# Altium project PA_CPLBridge_R01.PrjPcb
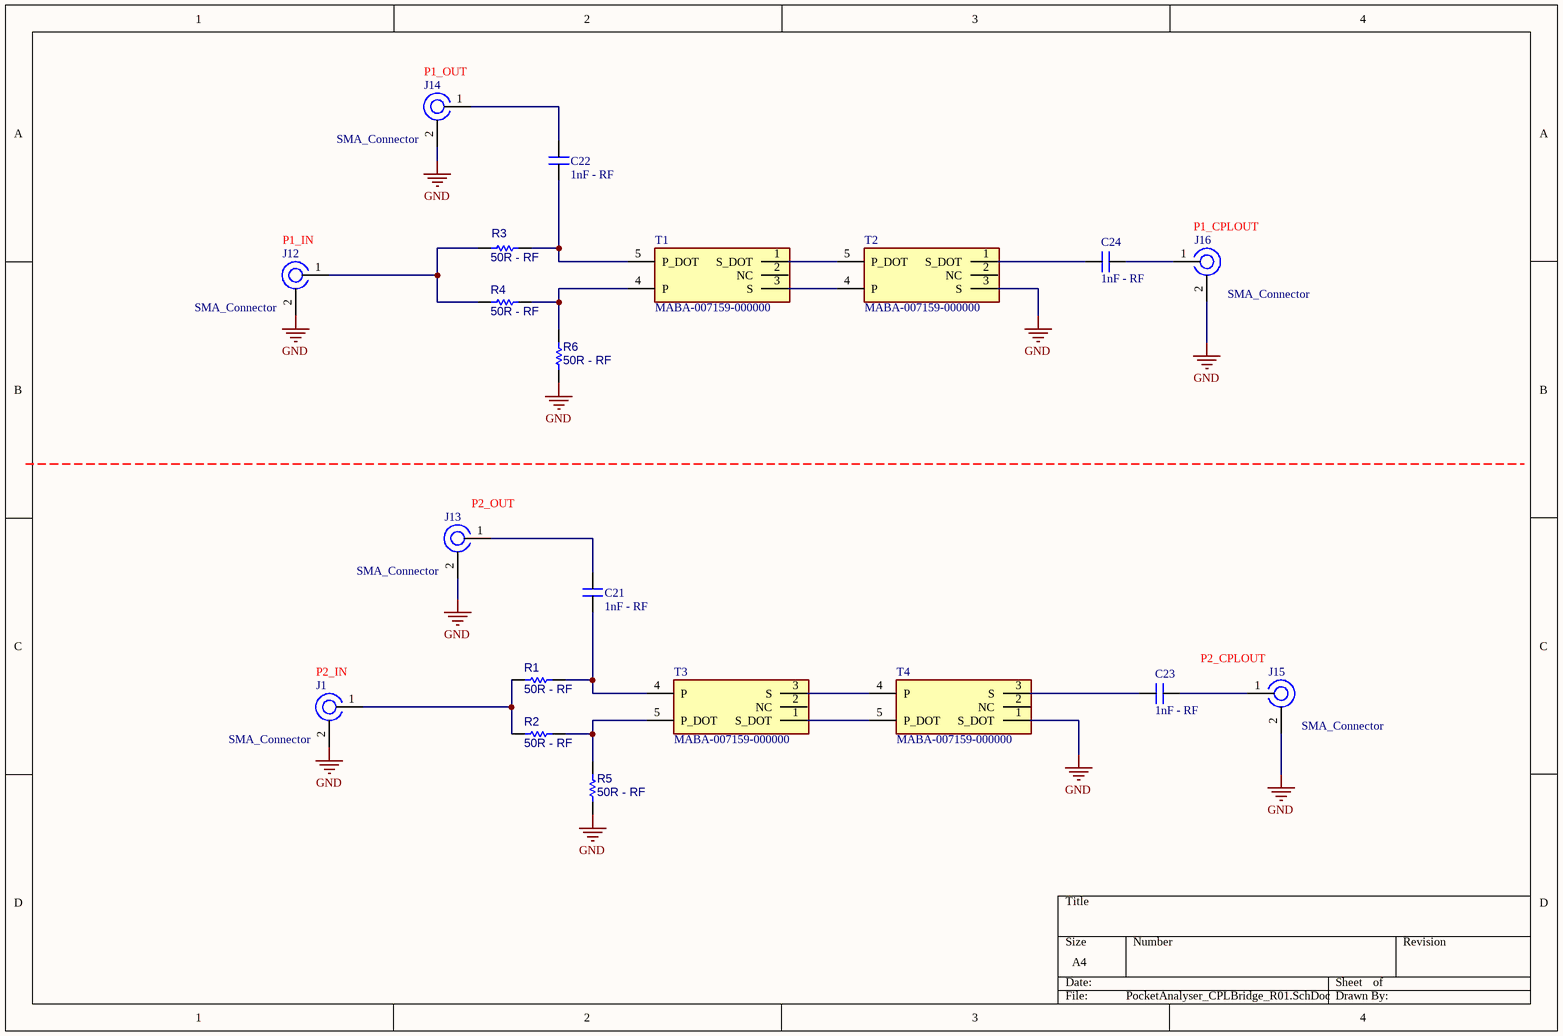
[diagram p0: PocketAnalyser_CPLBridge_R01.SchDoc]
1 sheet, 20 parts. Net scope: global (net labels, ports and power ports of the same name join across sheets).
Board file: PA_CPLBridgre_R01.PcbDoc

## Sheet PocketAnalyser_CPLBridge_R01.SchDoc
size A4; SheetNumber: 1; SheetTotal: 1

### Parts
C21  1nF - RF  [C_0603]
C22  1nF - RF  [C_0603]
C23  1nF - RF  [C_0603]
C24  1nF - RF  [C_0603]
J1  SMA_Connector  [SMA_Connector]
J12  SMA_Connector  [SMA_Connector]
J13  SMA_Connector  [SMA_Connector]
J14  SMA_Connector  [SMA_Connector]
J15  SMA_Connector  [SMA_Connector]
J16  SMA_Connector  [SMA_Connector]
R1  50R - RF  [R_0603]
R2  50R - RF  [R_0603]
R3  50R - RF  [R_0603]
R4  50R - RF  [R_0603]
R5  50R - RF  [R_0603]
R6  50R - RF  [R_0603]
T1  MABA-007159-000000  [MABA-007159-000000_1]
T2  MABA-007159-000000  [MABA-007159-000000_1]
T3  MABA-007159-000000  [MABA-007159-000000_1]
T4  MABA-007159-000000  [MABA-007159-000000_1]

### Nets
GND: J1.2 J12.2 J13.2 J14.2 J15.2 J16.2 R5.1 R6.1 T2.3(S) T4.1(S_DOT)
NetC21_1: C21.1 R1.1 T3.4(P)
NetC21_2: C21.2 J13.1
NetC22_1: C22.1 R3.1 T1.5(P_DOT)
NetC22_2: C22.2 J14.1
NetC23_1: C23.1 J15.1
NetC23_2: C23.2 T4.3(S)
NetC24_1: C24.1 J16.1
NetC24_2: C24.2 T2.1(S_DOT)
NetJ1_1: J1.1 R1.2 R2.2
NetJ12_1: J12.1 R3.2 R4.2
NetR2_1: R2.1 R5.2 T3.5(P_DOT)
NetR4_1: R4.1 R6.2 T1.4(P)
NetT1_1: T1.1(S_DOT) T2.5(P_DOT)
NetT1_3: T1.3(S) T2.4(P)
NetT3_1: T3.1(S_DOT) T4.5(P_DOT)
NetT3_3: T3.3(S) T4.4(P)

Not connected (* = marked no-connect by the designer): T1 2(NC); T2 2(NC); T3 2(NC); T4 2(NC)

### Notes on the sheet
- (near J14) P1_OUT
- (near J12) P1_IN
- (near J16) P1_CPLOUT
- (near J13) P2_OUT
- (near J1) P2_IN
- P2_CPLOUT

### Library data of the parts
C21-C24 = Ceramic Cap
J1 J12-J16 = SMA_Connector: Connector SMA
R1-R6 = Res1: Resistor
T1-T4 = MABA-007159-000000: Transformer; Manufacturer_Name: MACOM; Datasheet Link: http://cdn.macom.com/datasheets/MABA-007159-000000.pdf; Manufacturer_Part_Number: MABA-007159-000000; Mouser Part Number: 937-MABA007159000000; Mouser Price/Stock: https://www.mouser.co.uk/ProductDetail/MACOM/MABA-007159-000000?qs=3Wmz%2FrCSAaFBkdkj62uXUA%3D%3D